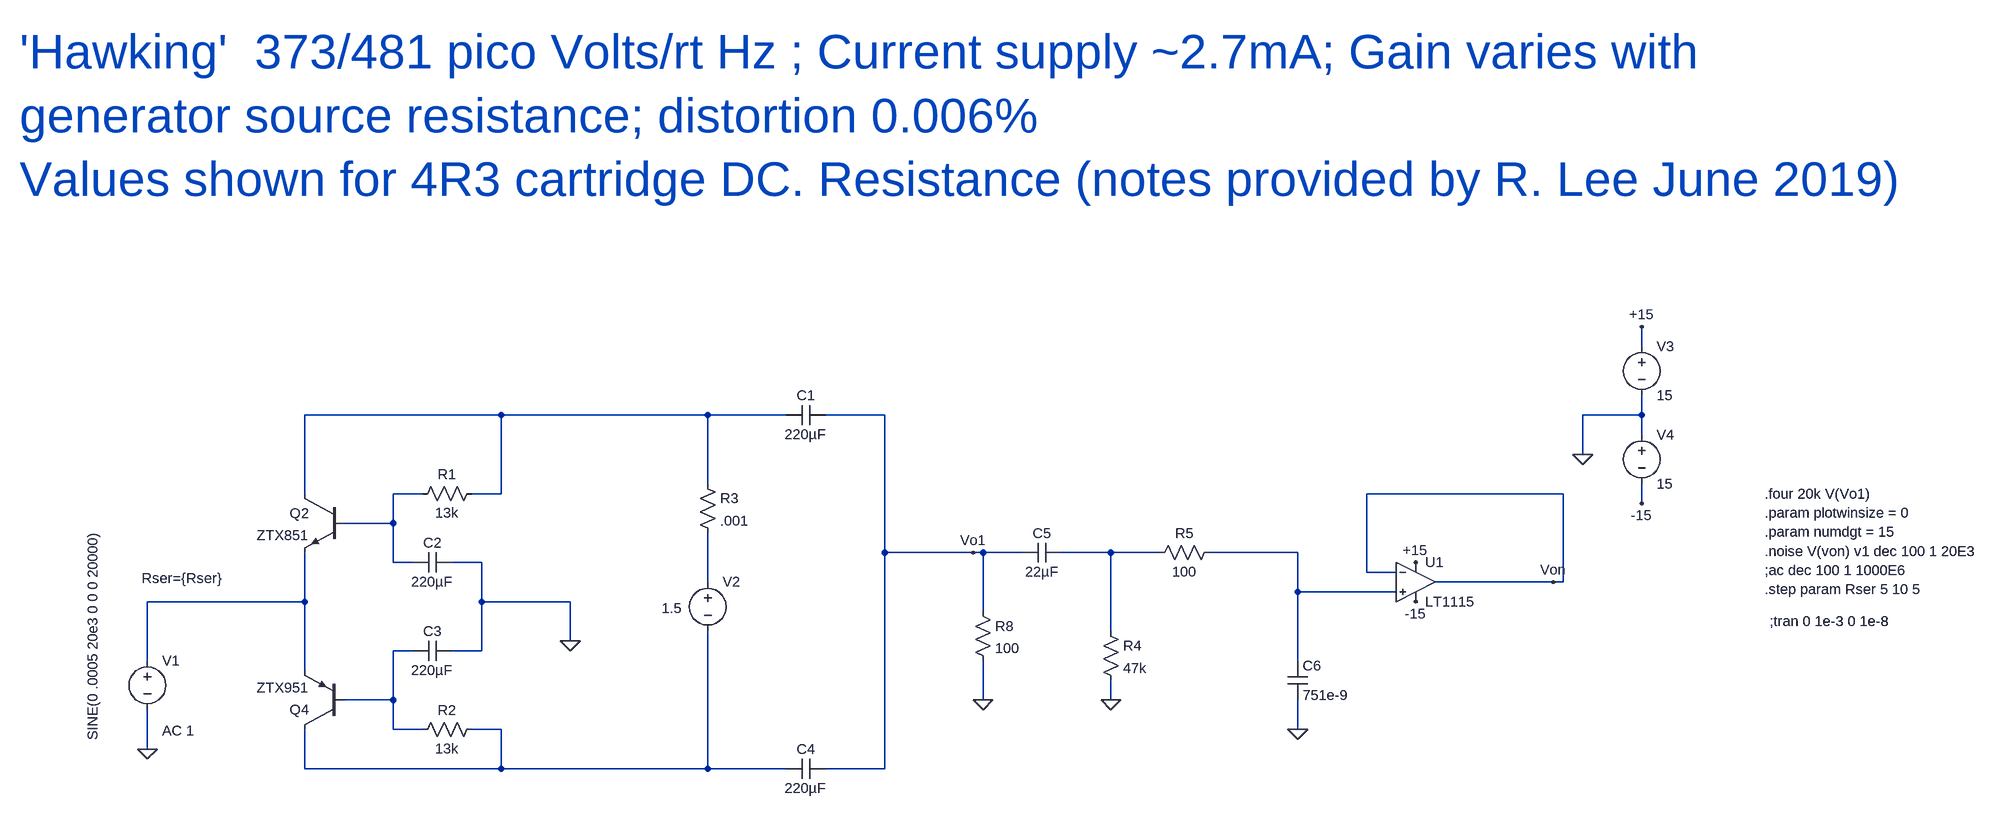
[diagram p0: schematic Hawking_comp.asc]
Hawking_comp.asc, the LTspice schematic file:
Version 4
SHEET 1 3280 680
WIRE 2032 -272 2032 -304
WIRE 176 -160 -144 -160
WIRE 512 -160 176 -160
WIRE 640 -160 512 -160
WIRE 800 -160 704 -160
WIRE 2032 -160 2032 -192
WIRE 2032 -160 1936 -160
WIRE 2032 -128 2032 -160
WIRE 1936 -96 1936 -160
WIRE 512 -48 512 -160
WIRE -144 -32 -144 -160
WIRE 48 -32 0 -32
WIRE 176 -32 176 -160
WIRE 176 -32 128 -32
WIRE 1904 -32 1584 -32
WIRE 2032 -16 2032 -48
WIRE 0 16 0 -32
WIRE 0 16 -80 16
WIRE 800 64 800 -160
WIRE 944 64 800 64
WIRE 960 64 944 64
WIRE 1024 64 960 64
WIRE 1168 64 1088 64
WIRE 1248 64 1168 64
WIRE 1472 64 1328 64
WIRE 0 80 0 16
WIRE 32 80 0 80
WIRE 144 80 96 80
WIRE 1584 96 1584 -32
WIRE 1632 96 1584 96
WIRE 512 112 512 32
WIRE 1888 112 1696 112
WIRE 1904 112 1904 -32
WIRE 1904 112 1888 112
WIRE 1472 128 1472 64
WIRE 1632 128 1472 128
WIRE -144 144 -144 64
WIRE -144 144 -400 144
WIRE 144 144 144 80
WIRE 288 144 144 144
WIRE 960 160 960 64
WIRE 1168 192 1168 64
WIRE 288 208 288 144
WIRE 32 224 0 224
WIRE 144 224 144 144
WIRE 144 224 96 224
WIRE -400 240 -400 144
WIRE 1472 240 1472 128
WIRE -144 256 -144 144
WIRE 0 304 0 224
WIRE 0 304 -80 304
WIRE 960 304 960 240
WIRE 1168 304 1168 272
WIRE 0 352 0 304
WIRE 48 352 0 352
WIRE 176 352 128 352
WIRE 1472 352 1472 304
WIRE -400 384 -400 320
WIRE -144 416 -144 352
WIRE 176 416 176 352
WIRE 176 416 -144 416
WIRE 512 416 512 192
WIRE 512 416 176 416
WIRE 640 416 512 416
WIRE 800 416 800 64
WIRE 800 416 704 416
FLAG 944 64 Vo1
FLAG -400 384 0
FLAG 288 208 0
FLAG 960 304 0
FLAG 1168 304 0
FLAG 1472 352 0
FLAG 1936 -96 0
FLAG 2032 -304 +15
FLAG 2032 -16 -15
FLAG 1664 144 -15
FLAG 1664 80 +15
FLAG 1888 112 Von
SYMBOL voltage -400 224 R0
WINDOW 3 -89 -203 VRight 2
WINDOW 123 24 130 Left 2
WINDOW 39 -9 -118 Left 2
SYMATTR Value SINE(0 .0005 20e3 0 0 0 20000)
SYMATTR Value2 AC 1
SYMATTR SpiceLine Rser={Rser}
SYMATTR InstName V1
SYMBOL voltage 512 96 R0
WINDOW 3 -75 59 Left 2
WINDOW 123 24 130 Left 2
WINDOW 39 0 0 Left 2
SYMATTR Value 1.5
SYMATTR InstName V2
SYMBOL res 944 144 R0
SYMATTR InstName R8
SYMATTR Value 100
SYMBOL npn -80 -32 M0
SYMATTR InstName Q2
SYMATTR Value ZTX851
SYMBOL pnp -80 352 R180
SYMATTR InstName Q4
SYMATTR Value ZTX951
SYMBOL res 144 -48 R90
WINDOW 0 0 56 VBottom 2
WINDOW 3 32 56 VTop 2
SYMATTR InstName R1
SYMATTR Value 13k
SYMBOL res 144 336 R90
WINDOW 0 0 56 VBottom 2
WINDOW 3 32 56 VTop 2
SYMATTR InstName R2
SYMATTR Value 13k
SYMBOL cap 96 64 R90
WINDOW 0 0 32 VBottom 2
WINDOW 3 32 32 VTop 2
SYMATTR InstName C2
SYMATTR Value 220µF
SYMBOL cap 96 208 R90
WINDOW 0 0 32 VBottom 2
WINDOW 3 32 32 VTop 2
SYMATTR InstName C3
SYMATTR Value 220µF
SYMBOL cap 704 -176 R90
WINDOW 0 0 32 VBottom 2
WINDOW 3 32 32 VTop 2
SYMATTR InstName C1
SYMATTR Value 220µF
SYMBOL cap 704 400 R90
WINDOW 0 0 32 VBottom 2
WINDOW 3 32 32 VTop 2
SYMATTR InstName C4
SYMATTR Value 220µF
SYMBOL res 496 -64 R0
SYMATTR InstName R3
SYMATTR Value .001
SYMBOL Opamps\\LT1115 1664 48 R0
SYMATTR InstName U1
SYMBOL cap 1024 48 M90
WINDOW 0 0 32 VBottom 2
WINDOW 3 32 32 VTop 2
SYMATTR InstName C5
SYMATTR Value 22µF
SYMBOL res 1152 176 R0
SYMATTR InstName R4
SYMATTR Value 47k
SYMBOL res 1344 48 R90
WINDOW 0 0 56 VBottom 2
WINDOW 3 32 56 VTop 2
SYMATTR InstName R5
SYMATTR Value 100
SYMBOL cap 1456 240 R0
SYMATTR InstName C6
SYMATTR Value 751e-9
SYMBOL voltage 2032 -288 R0
WINDOW 123 0 0 Left 2
WINDOW 39 0 0 Left 2
SYMATTR InstName V3
SYMATTR Value 15
SYMBOL voltage 2032 -144 R0
WINDOW 123 0 0 Left 2
WINDOW 39 0 0 Left 2
SYMATTR InstName V4
SYMATTR Value 15
TEXT 2240 176 Left 2 !;tran 0 1e-3 0 1e-8
TEXT 2232 -32 Left 2 !.four 20k V(Vo1)\n.param plotwinsize = 0\n.param numdgt = 15\n.noise V(von) v1 dec 100 1 20E3\n;ac dec 100 1 1000E6\n.step param Rser 5 10 5
TEXT -608 -752 Left 6 ;'Hawking'  373/481 pico Volts/rt Hz ; Current supply ~2.7mA; Gain varies with \ngenerator source resistance; distortion 0.006%\nValues shown for 4R3 cartridge DC. Resistance (notes provided by R. Lee June 2019)

The netlist it stands for:
* Hawking_comp.asc
V1 N006 0 SINE(0 .0005 20e3 0 0 0 20000) AC 1 Rser={Rser}
V2 N005 N008 1.5
R8 Vo1 0 100
Q2 N001 N002 N006 0 ZTX851
Q4 N008 N007 N006 0 ZTX951
R1 N001 N002 13k
R2 N008 N007 13k
C2 0 N002 220µF
C3 0 N007 220µF
C1 Vo1 N001 220µF
C4 Vo1 N008 220µF
R3 N001 N005 .001
XU1 N004 Von +15 -15 Von LT1028  ; LT1115, pins In+ In- V+ V- OUT
C5 Vo1 N003 22µF
R4 N003 0 47k
R5 N004 N003 100
C6 N004 0 751e-9
V3 +15 0 15
V4 0 -15 15
.model NPN NPN
.model PNP PNP
.lib standard.bjt
;tran 0 1e-3 0 1e-8
.four 20k V(Vo1)
.param plotwinsize = 0
.param numdgt = 15
.noise V(von) v1 dec 100 1 20E3
;ac dec 100 1 1000E6
.step param Rser 5 10 5
* 'Hawking'  373/481 pico Volts/rt Hz ; Current supply ~2.7mA; Gain varies with
* generator source resistance; distortion 0.006%
* Values shown for 4R3 cartridge DC. Resistance (notes provided by R. Lee June 2019)
.lib LTC.lib
.backanno
.end